# Altium schematic sheet CAN.SchDoc: Science - CAN
size Letter; DrawnBy: Christopher Arjune; Organization: UW Robotics; Address1: 200 University Avenue; Address2: Waterloo; Address3: Ontario; Address4: Canada N2L 3G6; SheetNumber: 4; SheetTotal: 5
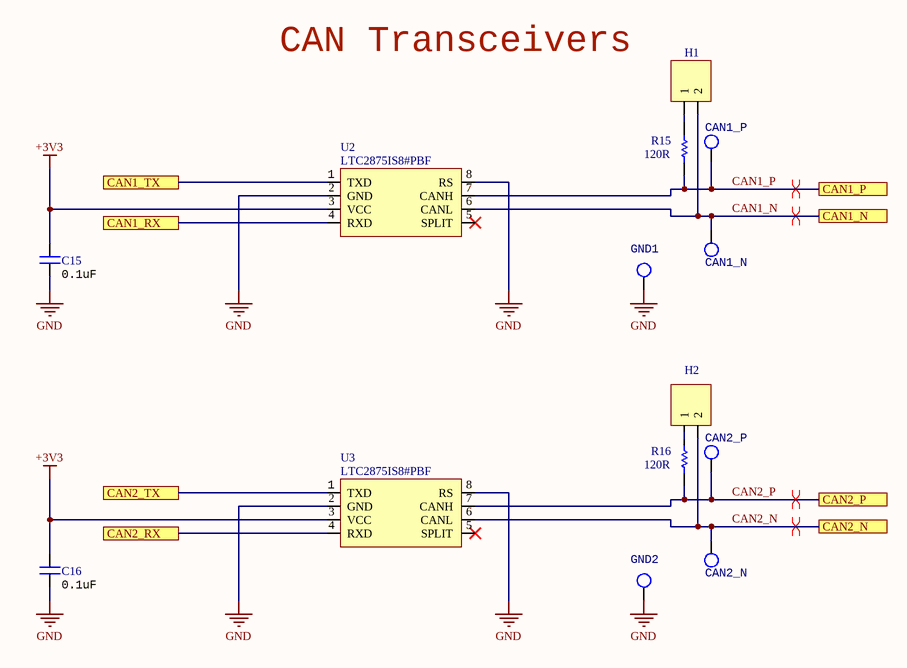
[diagram p0: CAN.SchDoc]

## Parts
C15  value 0.1uF  [CAPC0603(1608)55_N]  (hidden comment: CAP_0.1uF_16V_0603)
C16  value 0.1uF  [CAPC0603(1608)55_N]  (hidden comment: CAP_0.1uF_16V_0603)
CAN1_N  TESTPOINT_LOOP  [TESTPOINT_LOOP]  (value not drawn)
CAN1_P  TESTPOINT_LOOP  [TESTPOINT_LOOP]  (value not drawn)
CAN2_N  TESTPOINT_LOOP  [TESTPOINT_LOOP]  (value not drawn)
CAN2_P  TESTPOINT_LOOP  [TESTPOINT_LOOP]  (value not drawn)
GND1  TESTPOINT_LOOP  [TESTPOINT_LOOP]  (value not drawn)
GND2  TESTPOINT_LOOP  [TESTPOINT_LOOP]  (value not drawn)
H1  JUMPER_2  [HDR1X2]  (value not drawn)
H2  JUMPER_2  [HDR1X2]  (value not drawn)
R15  value 120R  [RESC0603(1608)_N]  (hidden comment: RES_120R_0603)
R16  value 120R  [RESC0603(1608)_N]  (hidden comment: RES_120R_0603)
U2  MPN: LTC2875IS8#PBF  [LT-S8_N]  (hidden comment: IC TXRX CAN)
U3  MPN: LTC2875IS8#PBF  [LT-S8_N]  (hidden comment: IC TXRX CAN)

## Ports
CAN1_N, CAN1_P, CAN1_RX, CAN1_TX, CAN2_N, CAN2_P, CAN2_RX, CAN2_TX

## Nets
+3V3: C15.2 C16.2 U2.3(VCC) U3.3(VCC)
GND: C15.1 C16.1 GND1.1 GND2.1 U2.2(GND) U2.8(RS) U3.2(GND) U3.8(RS)
CAN1_N: CAN1_N.1 H1.2 U2.6(CANL) ; port CAN1_N
CAN1_P: CAN1_P.1 R15.1 U2.7(CANH) ; port CAN1_P
CAN1_RX: U2.4(RXD) ; port CAN1_RX
CAN1_TX: U2.1(TXD) ; port CAN1_TX
CAN2_N: CAN2_N.1 H2.2 U3.6(CANL) ; port CAN2_N
CAN2_P: CAN2_P.1 R16.1 U3.7(CANH) ; port CAN2_P
CAN2_RX: U3.4(RXD) ; port CAN2_RX
CAN2_TX: U3.1(TXD) ; port CAN2_TX
NetH1_1: H1.1 R15.2
NetH2_1: H2.1 R16.2

Not connected (* = marked no-connect by the designer): U2 5(SPLIT)*; U3 5(SPLIT)*

## Layout directives
differential pair: CAN1_N, CAN1_P, CAN2_N, CAN2_P

## Notes on the sheet
- CAN Transceivers
- Title
- Size:
- Date:
- Letter
- Drawn By:
- Sheet
- of
- File:

## Library data of the parts
C15 C16 = CAP_0.1uF_16V_0603: CAP CER 0.1UF 16V X7R 0603; MPN: CC0603KRX7R7BB104; Manufacturer: Yageo; Dimensions: 0.063" L x 0.031" W (1.60mm x 0.80mm); Package: 0603 (1608 Metric); Temperature Coefficient: X7R; Voltage Rating: 16V; Supplier Part Number 1: 311-1088-1-ND; Supplier 1: Digi-Key
CAN1_N CAN1_P CAN2_N CAN2_P GND1 GND2 = TESTPOINT_LOOP: Loop testpoint through-hole pad; Manufacturer: Keystone Electronics; Manufacturer Part Number 1: 5002; Supplier Part Number 1: 36-5002-ND; Supplier 1: Digi-Key
H1 H2 = JUMPER_2: HEADER 2X1
R15 R16 = RES_120R_0603: RES SMD 120 OHM 5% 1/10W 0603; Manufacturer: Yageo; MPN: RC0603JR-07120RL; Package: 0603 (1608 Metric); Dimensions: 0.063" L x 0.031" W (1.60mm x 0.80mm); Tolerance: 5%; Supplier Part Number 1: 311-120GRCT-ND; Supplier 1: Digi-Key
U2 U3 = LTC2875: IC TXRX CAN 4MBPS 8SO; Manufacturer: Linear Technologies; Package: 8-SOIC (0.154", 3.90mm Width); ComponentLink1Description: Datasheet; ComponentLink1URL: https://www.analog.com/media/en/technical-documentation/data-sheets/2875f.pdf; Supplier Part Number 1: LTC2875IS8#PBF-ND; Supplier 1: Digi-Key